# Altium schematic sheet minna_schematic_io.SchDoc: Minna Schematic Input Output
size A4; Author: Chris Hettrick; CompanyName: Populate All The Resistors; DrawnBy: Chris Hettrick; Engineer: Chris Hettrick; Organization: Populate All The Resistors; DocumentNumber: 2; Revision: 0.4; SheetNumber: 2; SheetTotal: 2; DocumentName: minna_schematic_io.SchDoc; ProjectName: smari
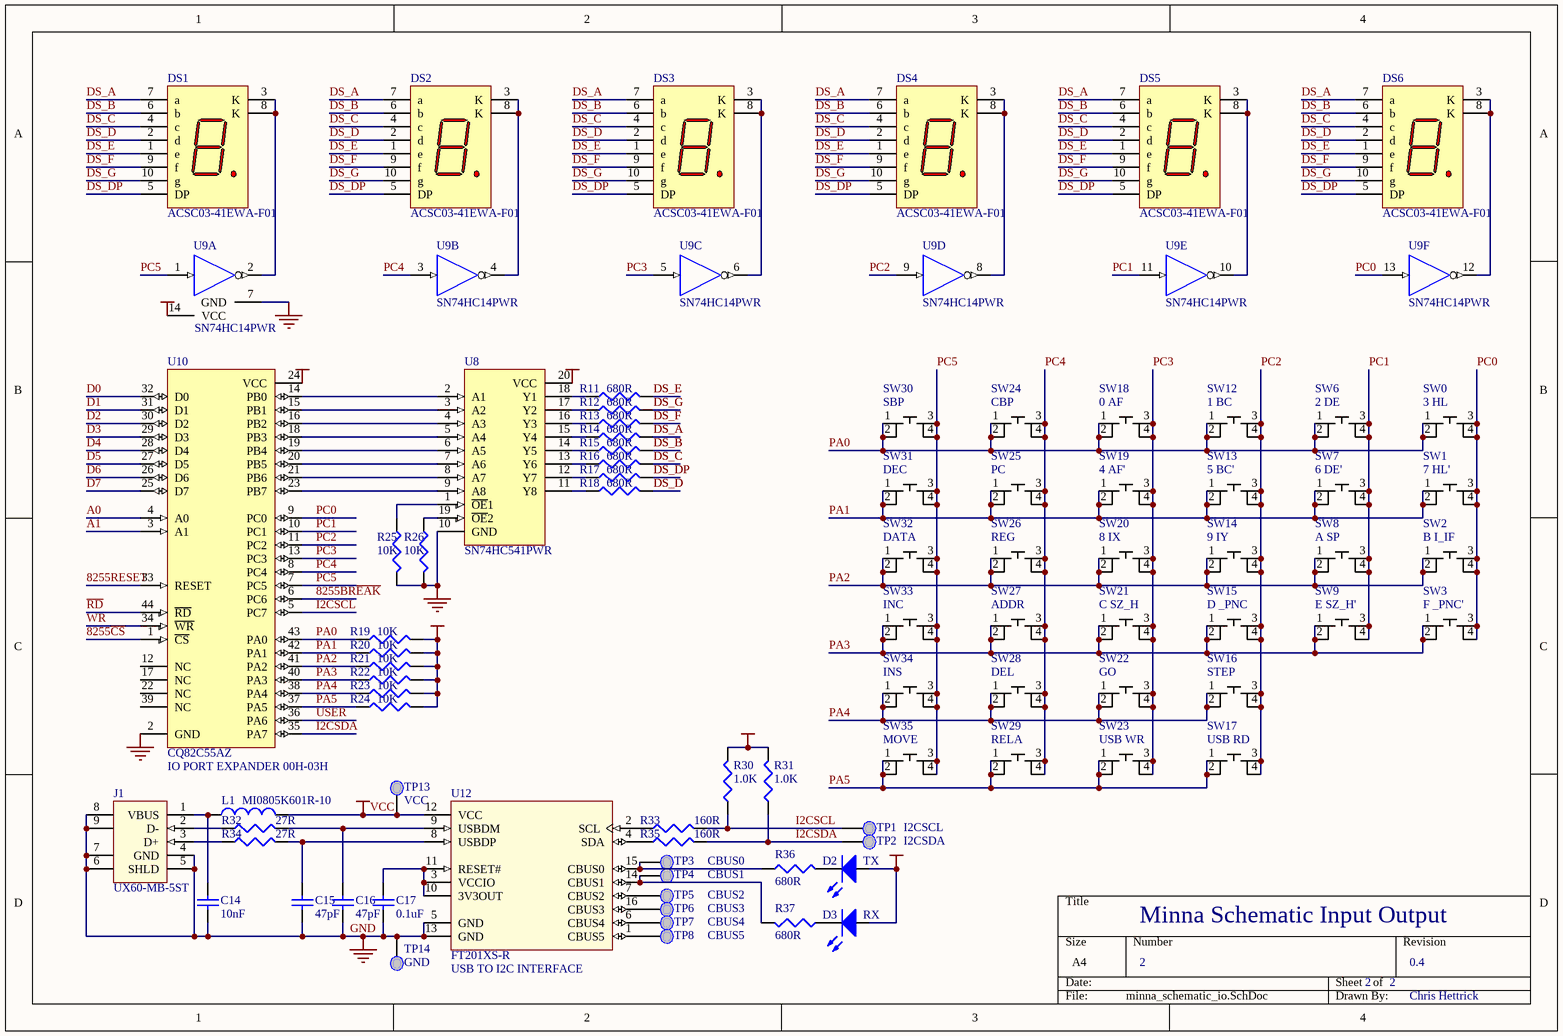
[diagram p0: minna_schematic_io.SchDoc]

## Parts
C14  10nF  [0603]
C15  47pF  [0603]
C16  47pF  [0603]
C17  0.1uF  [0603]
D2  TX  [APG1608]
D3  RX  [APG1608]
DS1  ACSC03-41EWA-F01  [ACSC03-41EWA-F01]
DS2  ACSC03-41EWA-F01  [ACSC03-41EWA-F01]
DS3  ACSC03-41EWA-F01  [ACSC03-41EWA-F01]
DS4  ACSC03-41EWA-F01  [ACSC03-41EWA-F01]
DS5  ACSC03-41EWA-F01  [ACSC03-41EWA-F01]
DS6  ACSC03-41EWA-F01  [ACSC03-41EWA-F01]
J1  UX60-MB-5ST  [UX60-MB-5ST]
L1  MI0805K601R-10  [0805]
R11  680R  [0603]
R12  680R  [0603]
R13  680R  [0603]
R14  680R  [0603]
R15  680R  [0603]
R16  680R  [0603]
R17  680R  [0603]
R18  680R  [0603]
R19  10K  [0603]
R20  10K  [0603]
R21  10K  [0603]
R22  10K  [0603]
R23  10K  [0603]
R24  10K  [0603]
R25  10K  [0603]
R26  10K  [0603]
R30  1.0K  [0603]
R31  1.0K  [0603]
R32  27R  [0603]
R33  160R  [0603]
R34  27R  [0603]
R35  160R  [0603]
R36  680R  [0603]
R37  680R  [0603]
SW0  3 HL  [PTS645SM43SMTR LFS]
SW1  7 HL'  [PTS645SM43SMTR LFS]
SW2  B I_IF  [PTS645SM43SMTR LFS]
SW3  F _PNC'  [PTS645SM43SMTR LFS]
SW6  2 DE  [PTS645SM43SMTR LFS]
SW7  6 DE'  [PTS645SM43SMTR LFS]
SW8  A SP  [PTS645SM43SMTR LFS]
SW9  E SZ_H'  [PTS645SM43SMTR LFS]
SW12  1 BC  [PTS645SM43SMTR LFS]
SW13  5 BC'  [PTS645SM43SMTR LFS]
SW14  9 IY  [PTS645SM43SMTR LFS]
SW15  D _PNC  [PTS645SM43SMTR LFS]
SW16  STEP  [PTS645SM43SMTR LFS]
SW17  USB RD  [PTS645SM43SMTR LFS]
SW18  0 AF  [PTS645SM43SMTR LFS]
SW19  4 AF'  [PTS645SM43SMTR LFS]
SW20  8 IX  [PTS645SM43SMTR LFS]
SW21  C SZ_H  [PTS645SM43SMTR LFS]
SW22  GO  [PTS645SM43SMTR LFS]
SW23  USB WR  [PTS645SM43SMTR LFS]
SW24  CBP  [PTS645SM43SMTR LFS]
SW25  PC  [PTS645SM43SMTR LFS]
SW26  REG  [PTS645SM43SMTR LFS]
SW27  ADDR  [PTS645SM43SMTR LFS]
SW28  DEL  [PTS645SM43SMTR LFS]
SW29  RELA  [PTS645SM43SMTR LFS]
SW30  SBP  [PTS645SM43SMTR LFS]
SW31  DEC  [PTS645SM43SMTR LFS]
SW32  DATA  [PTS645SM43SMTR LFS]
SW33  INC  [PTS645SM43SMTR LFS]
SW34  INS  [PTS645SM43SMTR LFS]
SW35  MOVE  [PTS645SM43SMTR LFS]
TP1  I2CSCL  [TP_ICT]  (no BOM)
TP2  I2CSDA  [TP_ICT]  (no BOM)
TP3  CBUS0  [TP_ICT]  (no BOM)
TP4  CBUS1  [TP_ICT]  (no BOM)
TP5  CBUS2  [TP_ICT]  (no BOM)
TP6  CBUS3  [TP_ICT]  (no BOM)
TP7  CBUS4  [TP_ICT]  (no BOM)
TP8  CBUS5  [TP_ICT]  (no BOM)
TP13  VCC  [TP_ICT]  (no BOM)
TP14  GND  [TP_ICT]  (no BOM)
U8  SN74HC541PWR  [PW020]
U9  SN74HC14PWR  [PW014]  (parts A,B,C,D,E,F of 6)
U10  CQ82C55AZ  Notes: IO PORT EXPANDER 00H-03H  [MQFP-44]
U12  FT201XS-R  Notes: USB TO I2C INTERFACE  [SSOP-16]

## Nets
GND: C14.2 C15.2 C16.2 C17.1 J1.4(GND) J1.5(SHLD) J1.6(SHLD) J1.7(SHLD) J1.8(SHLD) J1.9(SHLD) R25.2 R26.2 TP14.TP U8.10(GND) U9.7(GND) U10.2(GND) U12.5(GND) U12.13(GND)
VCC: D2.1(A) D3.1(A) L1.2 R19.2 R20.2 R21.2 R22.2 R23.2 R24.2 R30.2 R31.2 TP13.TP U8.20(VCC) U9.14(VCC) U10.24(VCC) U12.12(VCC)
8255~{BREAK}: U10.6(PC6)
8255~{CS}: U10.1(~{CS})
8255RESET: U10.33(RESET)
A0: U10.4(A0)
A1: U10.3(A1)
D0: U10.32(D0)
D1: U10.31(D1)
D2: U10.30(D2)
D3: U10.29(D3)
D4: U10.28(D4)
D5: U10.27(D5)
D6: U10.26(D6)
D7: U10.25(D7)
DS_A: DS1.7(a) DS2.7(a) DS3.7(a) DS4.7(a) DS5.7(a) DS6.7(a) R14.2
DS_B: DS1.6(b) DS2.6(b) DS3.6(b) DS4.6(b) DS5.6(b) DS6.6(b) R15.2
DS_C: DS1.4(c) DS2.4(c) DS3.4(c) DS4.4(c) DS5.4(c) DS6.4(c) R16.2
DS_D: DS1.2(d) DS2.2(d) DS3.2(d) DS4.2(d) DS5.2(d) DS6.2(d) R18.2
DS_DP: DS1.5(DP) DS2.5(DP) DS3.5(DP) DS4.5(DP) DS5.5(DP) DS6.5(DP) R17.2
DS_E: DS1.1(e) DS2.1(e) DS3.1(e) DS4.1(e) DS5.1(e) DS6.1(e) R11.2
DS_F: DS1.9(f) DS2.9(f) DS3.9(f) DS4.9(f) DS5.9(f) DS6.9(f) R13.2
DS_G: DS1.10(g) DS2.10(g) DS3.10(g) DS4.10(g) DS5.10(g) DS6.10(g) R12.2
I2CSCL: R30.1 R33.2 TP1.TP U10.5(PC7)
I2CSDA: R31.1 R35.2 TP2.TP U10.35(PA7)
PA0: R19.1 SW0.1 SW0.2 SW6.1 SW6.2 SW12.1 SW12.2 SW18.1 SW18.2 SW24.1 SW24.2 SW30.1 SW30.2 U10.43(PA0)
PA1: R20.1 SW1.1 SW1.2 SW7.1 SW7.2 SW13.1 SW13.2 SW19.1 SW19.2 SW25.1 SW25.2 SW31.1 SW31.2 U10.42(PA1)
PA2: R21.1 SW2.1 SW2.2 SW8.1 SW8.2 SW14.1 SW14.2 SW20.1 SW20.2 SW26.1 SW26.2 SW32.1 SW32.2 U10.41(PA2)
PA3: R22.1 SW3.1 SW3.2 SW9.1 SW9.2 SW15.1 SW15.2 SW21.1 SW21.2 SW27.1 SW27.2 SW33.1 SW33.2 U10.40(PA3)
PA4: R23.1 SW16.1 SW16.2 SW22.1 SW22.2 SW28.1 SW28.2 SW34.1 SW34.2 U10.38(PA4)
PA5: R24.1 SW17.1 SW17.2 SW23.1 SW23.2 SW29.1 SW29.2 SW35.1 SW35.2 U10.37(PA5)
PC0: SW0.3 SW0.4 SW1.3 SW1.4 SW2.3 SW2.4 SW3.3 SW3.4 U9.13(A) U10.9(PC0)
PC1: SW6.3 SW6.4 SW7.3 SW7.4 SW8.3 SW8.4 SW9.3 SW9.4 U9.11(A) U10.10(PC1)
PC2: SW12.3 SW12.4 SW13.3 SW13.4 SW14.3 SW14.4 SW15.3 SW15.4 SW16.3 SW16.4 SW17.3 SW17.4 U9.9(A) U10.11(PC2)
PC3: SW18.3 SW18.4 SW19.3 SW19.4 SW20.3 SW20.4 SW21.3 SW21.4 SW22.3 SW22.4 SW23.3 SW23.4 U9.5(A) U10.13(PC3)
PC4: SW24.3 SW24.4 SW25.3 SW25.4 SW26.3 SW26.4 SW27.3 SW27.4 SW28.3 SW28.4 SW29.3 SW29.4 U9.3(A) U10.8(PC4)
PC5: SW30.3 SW30.4 SW31.3 SW31.4 SW32.3 SW32.4 SW33.3 SW33.4 SW34.3 SW34.4 SW35.3 SW35.4 U9.1(A) U10.7(PC5)
~{RD}: U10.44(~{RD})
USER: U10.36(PA6)
~{WR}: U10.34(~{WR})
NetC14_1: C14.1 J1.1(VBUS) L1.1
NetC15_1: C15.1 R34.2 U12.8(USBDP)
NetC16_1: C16.1 R32.2 U12.9(USBDM)
NetC17_2: C17.2 U12.3(VCCIO) U12.10(3V3OUT) U12.11(RESET#)
NetD2_2: D2.2(K) R36.2
NetD3_2: D3.2(K) R37.1
NetDS1_3: DS1.3(K) DS1.8(K) U9.2(~{Y})
NetDS2_3: DS2.3(K) DS2.8(K) U9.4(~{Y})
NetDS3_3: DS3.3(K) DS3.8(K) U9.6(~{Y})
NetDS4_3: DS4.3(K) DS4.8(K) U9.8(~{Y})
NetDS5_3: DS5.3(K) DS5.8(K) U9.10(~{Y})
NetDS6_3: DS6.3(K) DS6.8(K) U9.12(~{Y})
NetJ1_2: J1.2(D-) R32.1
NetJ1_3: J1.3(D+) R34.1
NetR11_1: R11.1 U8.18(Y1)
NetR12_1: R12.1 U8.17(Y2)
NetR13_1: R13.1 U8.16(Y3)
NetR14_1: R14.1 U8.15(Y4)
NetR15_1: R15.1 U8.14(Y5)
NetR16_1: R16.1 U8.13(Y6)
NetR17_1: R17.1 U8.12(Y7)
NetR18_1: R18.1 U8.11(Y8)
NetR25_1: R25.1 U8.1(~{OE}1)
NetR26_1: R26.1 U8.19(~{OE}2)
NetR33_1: R33.1 U12.2(SCL)
NetR35_1: R35.1 U12.4(SDA)
NetR36_1: R36.1 TP3.TP U12.15(CBUS0)
NetR37_2: R37.2 TP4.TP U12.14(CBUS1)
NetTP5_TP: TP5.TP U12.7(CBUS2)
NetTP6_TP: TP6.TP U12.16(CBUS3)
NetTP7_TP: TP7.TP U12.6(CBUS4)
NetTP8_TP: TP8.TP U12.1(CBUS5)
NetU8_2: U8.2(A1) U10.14(PB0)
NetU8_3: U8.3(A2) U10.15(PB1)
NetU8_4: U8.4(A3) U10.16(PB2)
NetU8_5: U8.5(A4) U10.18(PB3)
NetU8_6: U8.6(A5) U10.19(PB4)
NetU8_7: U8.7(A6) U10.20(PB5)
NetU8_8: U8.8(A7) U10.21(PB6)
NetU8_9: U8.9(A8) U10.23(PB7)

Not connected (* = marked no-connect by the designer): U10 12(NC) 17(NC) 22(NC) 39(NC)

## Notes on the sheet
- Title
- Size:
- Date:
- A4
- Number:
- Time:
- Revision:
- Sheet
- of
- File:

## Library data of the parts
C14 = C0603: CAP CER 10000PF 50V 10% X7R 0603; Dist: Digikey; DistPN: 399-1091-1-ND; Load: yes; Mfgr: Kemet; MfgrPN: C0603C103K5RACTU; Polarized: no; Value: 10nF; Notes: *; Package: 0603
C15 C16 = C0603: CAP CER 47PF 50V 5% NP0 0603; Dist: Digikey; DistPN: 399-1056-1-ND; Load: yes; Mfgr: Kemet; MfgrPN: C0603C470J5GACTU; Polarized: no; Value: 47pF; Notes: *; Package: 0603
C17 = C0603: CAP .10UF 16V CERAMIC X7R 0603; Dist: Digikey; DistPN: 399-1096-1-ND; Load: yes; Mfgr: Kemet; MfgrPN: C0603C104K4RACTU; Polarized: no; Value: 0.1uF; Notes: *; Package: 0603
D2 D3 = LTST-C190KRKT: LED SUPER RED CLEAR 0603 SMD; Dist: Digikey; DistPN: 160-1436-2-ND; Load: yes; Mfgr: Lite-On; MfgrPN: LTST-C190KRKT; Package: 0603; Polarized: yes
  D2: Value: TX
  D3: Value: RX
DS1-DS6 = ACSC03-41EWA-F01: DISPLAY 0.3" 627NM SGL RED SMD; Dist: Digikey; DistPN: 754-1037-1-ND; Load: yes; Mfgr: Kingbright Corp; MfgrPN: ACSC03-41EWA-F01; Package: SMD-10; Polarized: yes; Value: ACSC03-41EWA-F01
J1 = UX60-MB-5ST: CONN RECEPT MINI USB2.0 5POS; Load: yes; Dist: Digikey; Mfgr: Hirose; DistPN: H2959CT-ND; Value: UX60-MB-5ST; Polarized: yes; Notes: *; MfgrPN: UX60-MB-5ST; Package: USB Mini B 5 Pin Receptacle
L1 = MI0805K601R-10: FERRITE CHIP POWER 600 OHM SMD; Load: yes; Dist: Digikey; Mfgr: Laird; DistPN: 240-2390-1-ND; Polarized: no; Value: MI0805K601R-10; Package: 0805; MfgrPN: MI0805K601R-10
R11-R18 R36 R37 = MCR03EZPFX: RES 680 OHM 1/10W 1% 0603 SMD; Dist: Digikey; DistPN: P680HCT-ND; Mfgr: Panasonic; MfgrPN: ERJ-3EKF6800V; Load: yes; Polarized: no; Value: 680R; Package: 0603
R19-R26 = MCR03EZPFX: RES 10.0K OHM 1/10W 1% 0603 SMD; Dist: Digikey; DistPN: P10.0KHCT-ND; Mfgr: Panasonic; MfgrPN: ERJ-3EKF1002V; Load: yes; Polarized: no; Value: 10K; Package: 0603
R30 R31 = ERJ-3EKF1002V: RES 1.00K OHM 1/10W 1% 0603 SMD; Dist: Digikey; DistPN: P1.00KHCT-ND; Mfgr: Panasonic; MfgrPN: ERJ-3EKF1001V; Load: yes; Polarized: no; Value: 1.0K; Package: 0603
R32 R34 = ERJ-3EKF1002V: RES 27.0 OHM 1/10W 1% 0603 SMD; Dist: Digikey; DistPN: P27.0HCT-ND; Mfgr: Panasonic; MfgrPN: ERJ-3EKF27R0V; Load: yes; Polarized: no; Value: 27R; Package: 0603
R33 R35 = ERJ-3EKF1002V: RES 160 OHM 1/10W 1% 0603 SMD; Dist: Digikey; DistPN: P160HCT-ND; Mfgr: Panasonic; MfgrPN: ERJ-3EKF1600V; Load: yes; Polarized: no; Value: 160R; Package: 0603
SW0-SW3 SW6-SW9 SW12-SW35 = PTS645SM43SMTR LFS: SWITCH TACT 6MM 160GF H=4.3MM; Dist: Digikey; DistPN: CKN9112CT-ND; Load: yes; Mfgr: C&K Components; MfgrPN: PTS645SM43SMTR LFS; Package: SMD-6x6; Polarized: yes
  SW0: Value: 3 HL
  SW1: Value: 7 HL'
  SW2: Value: B I_IF
  SW3: Value: F _PNC'
  SW6: Value: 2 DE
  SW7: Value: 6 DE'
  SW8: Value: A SP
  SW9: Value: E SZ_H'
  SW12: Value: 1 BC
  SW13: Value: 5 BC'
  SW14: Value: 9 IY
  SW15: Value: D _PNC
  SW16: Value: STEP
  SW17: Value: USB RD
  SW18: Value: 0 AF
  SW19: Value: 4 AF'
  SW20: Value: 8 IX
  SW21: Value: C SZ_H
  SW22: Value: GO
  SW23: Value: USB WR
  SW24: Value: CBP
  SW25: Value: PC
  SW26: Value: REG
  SW27: Value: ADDR
  SW28: Value: DEL
  SW29: Value: RELA
  SW30: Value: SBP
  SW31: Value: DEC
  SW32: Value: DATA
  SW33: Value: INC
  SW34: Value: INS
  SW35: Value: MOVE
TP1-TP8 TP13 TP14 = TP_ICT: TEST POINT; Load: DNP; Polarized: no
  TP1: Value: I2CSCL
  TP2: Value: I2CSDA
  TP3: Value: CBUS0
  TP4: Value: CBUS1
  TP5: Value: CBUS2
  TP6: Value: CBUS3
  TP7: Value: CBUS4
  TP8: Value: CBUS5
  TP13: Value: VCC
  TP14: Value: GND
U8 = SN74HC541PWR: IC BUFF/DVR TRI-ST 8BIT 20TSSOP; Dist: Digikey; DistPN: 296-8335-1-ND; Load: yes; Mfgr: Texas Instruments; MfgrPN: SN74HC541PWR; Package: TSSOP-20; Polarized: yes; Value: SN74HC541PWR
U9 = SN74HC14PWR: IC HEX SCHMITT-TRIG INV 14-TSSOP; Dist: Digikey; DistPN: 296-8234-1-ND; Load: yes; Mfgr: Texas Instruments; MfgrPN: SN74HC14PWR; Package: TSSOP-14; Polarized: yes; Value: SN74HC14PWR
U10 = CMQ82C55AZ: IC I/O EXPANDER 24B 44MQFP; Dist: Digikey; DistPN: CQ82C55AZ-ND; Load: yes; Mfgr: Intersil; MfgrPN: CQ82C55AZ; Package: MQFP-44; Polarized: yes; Value: CQ82C55AZ
U12 = FT201XS-R: IC USB FS I2C SSOP-16; Mfgr: FTDI; Load: yes; Dist: Digikey; DistPN: 768-1136-1-ND; MfgrPN: FT201XS-R; Package: SSOP-16; Polarized: yes; Value: FT201XS-R